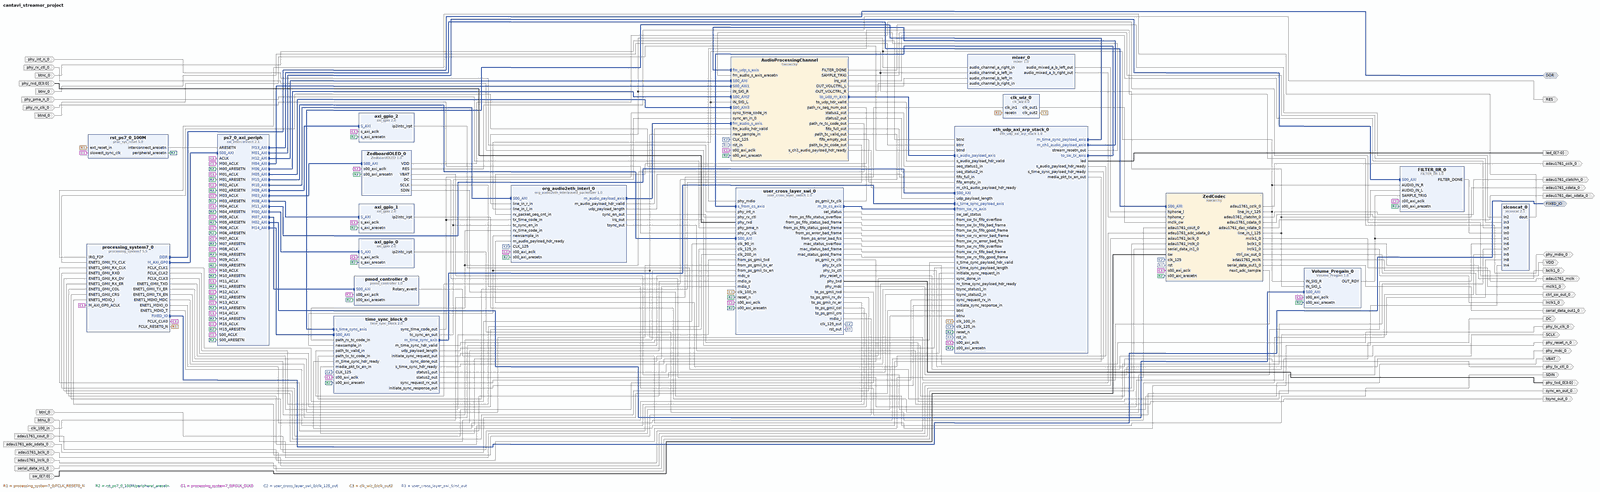
[diagram p0: block diagram of the top level, whole]
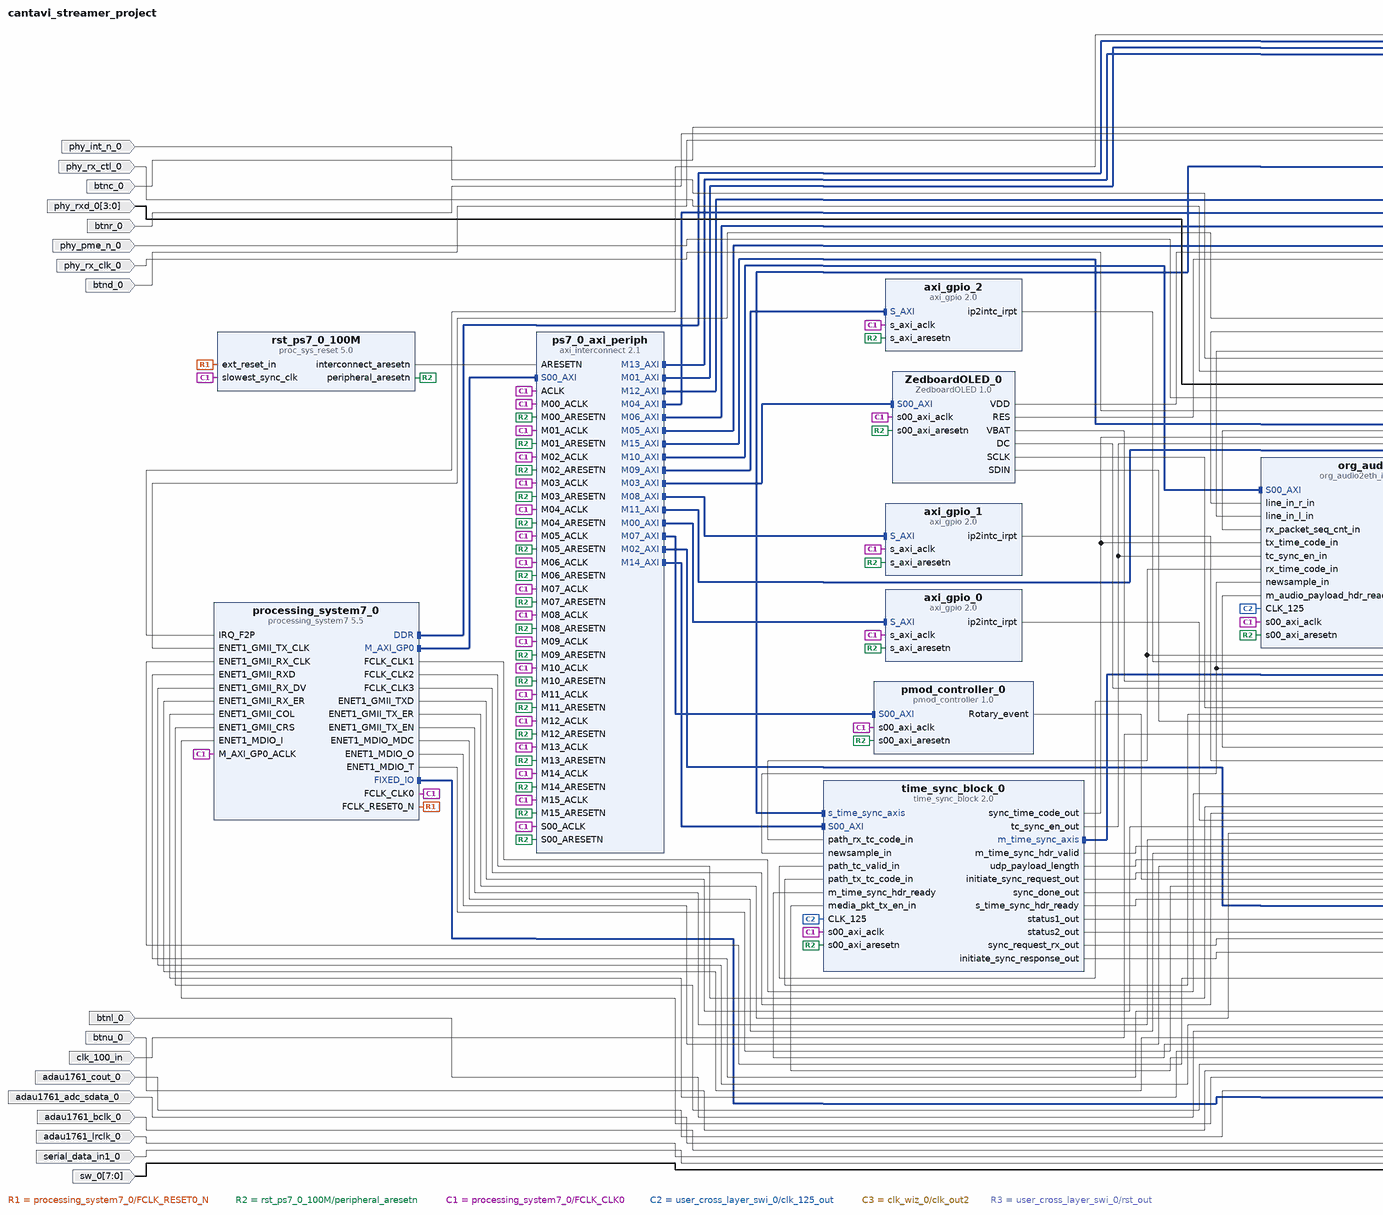
[diagram p1: block diagram of the top level, left part]
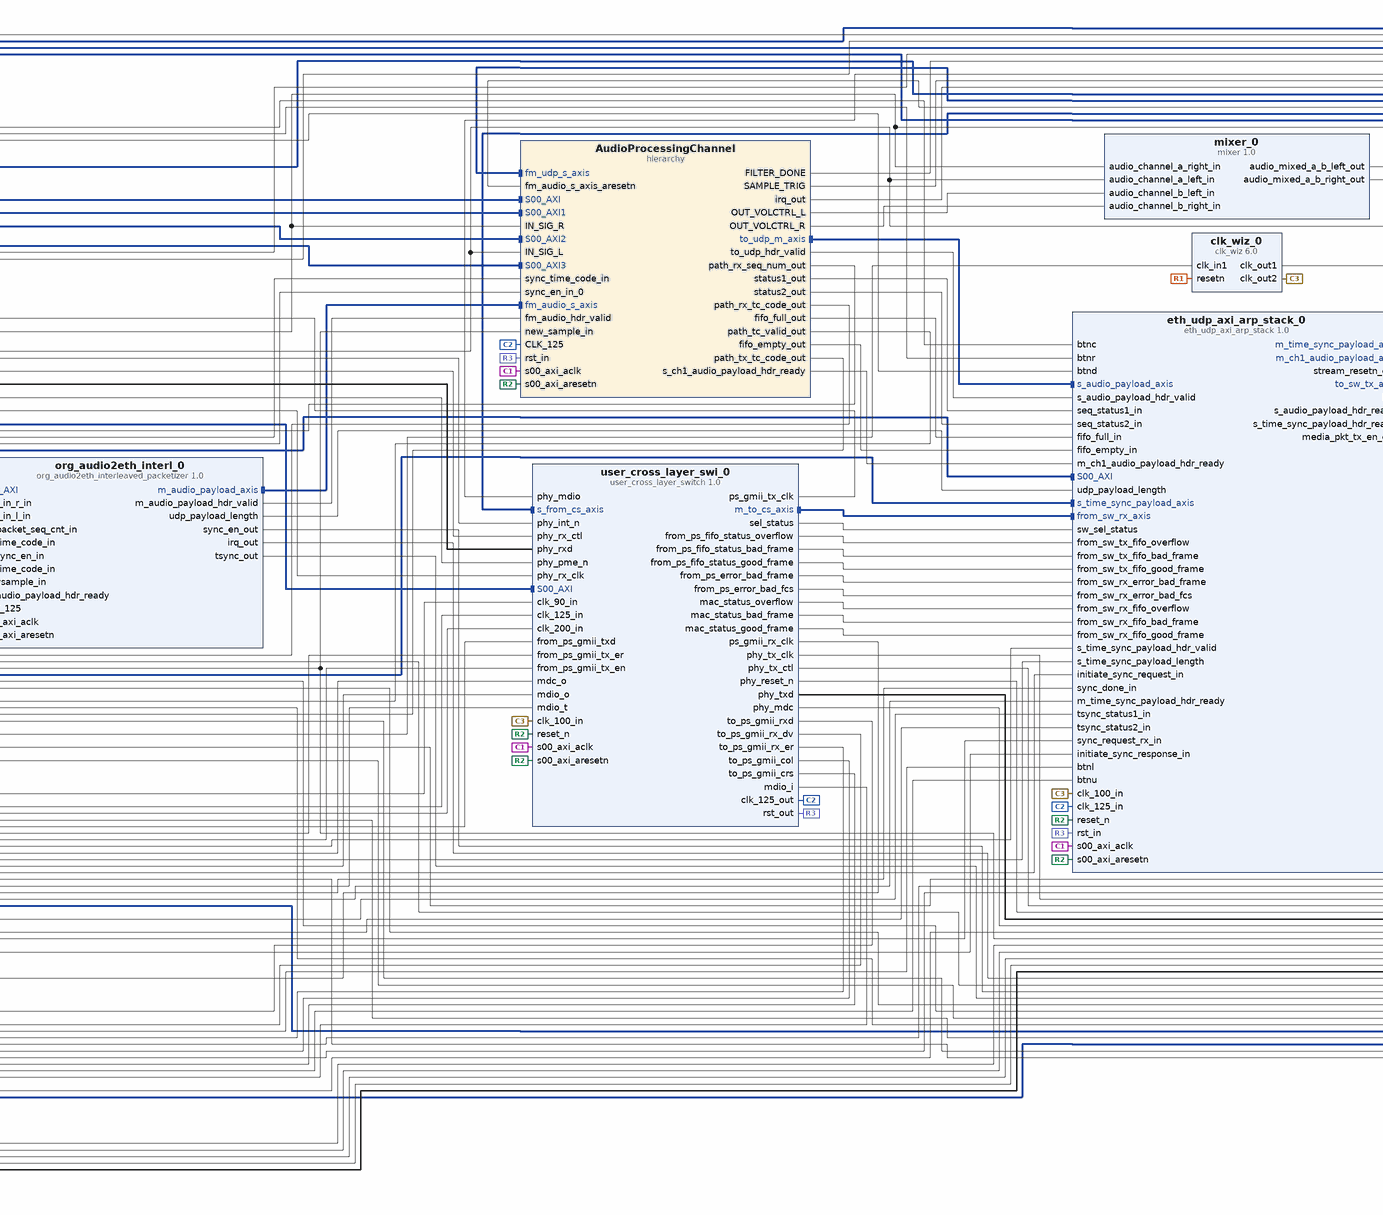
[diagram p2: block diagram of the top level, centre part]
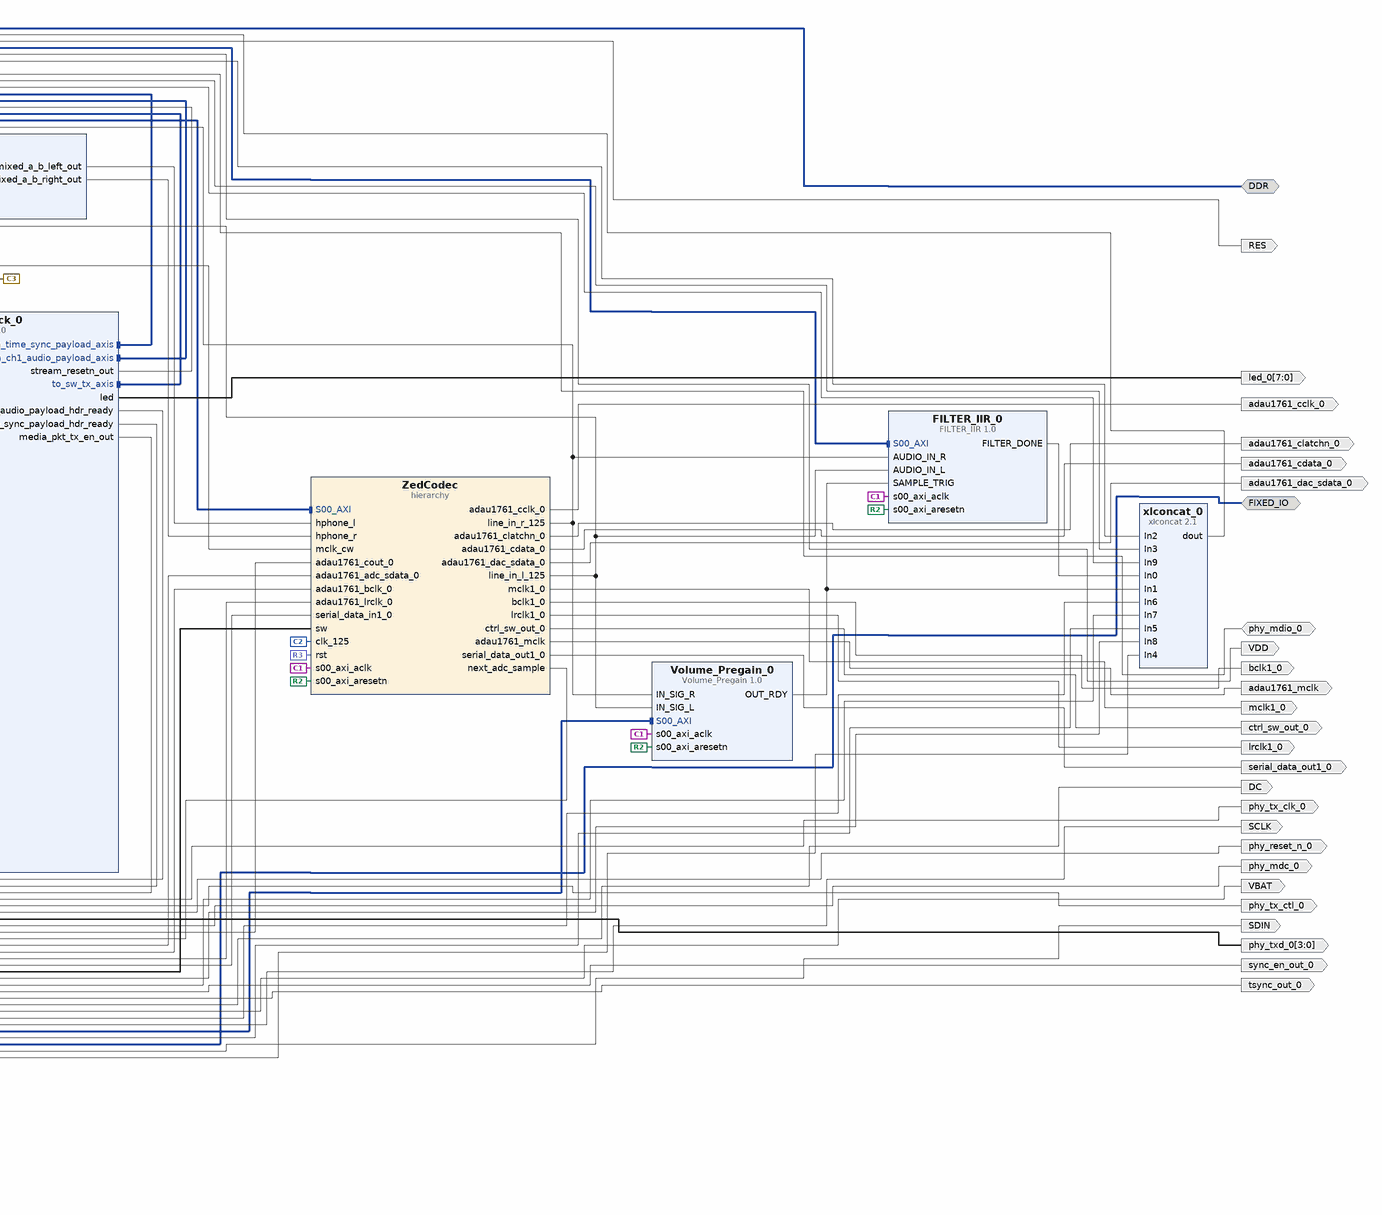
[diagram p3: block diagram of the top level, right part]
# Vivado block design cantavi_streamer_project, xc7z020clg484-1, Vivado 2018.3
create_bd_design cantavi_streamer_project

create_bd_intf_port -mode Master -vlnv xilinx.com:interface:ddrx_rtl:1.0 DDR
create_bd_intf_port -mode Master -vlnv xilinx.com:display_processing_system7:fixedio_rtl:1.0 FIXED_IO
create_bd_port -dir O VDD
create_bd_port -dir O RES
create_bd_port -dir O VBAT
create_bd_port -dir O DC
create_bd_port -dir O SCLK
create_bd_port -dir O SDIN
create_bd_port -dir O -from 3 -to 0 phy_txd_0
create_bd_port -dir O phy_tx_ctl_0
create_bd_port -dir O phy_reset_n_0
create_bd_port -dir I phy_int_n_0
create_bd_port -dir I phy_rx_ctl_0
create_bd_port -dir I -from 3 -to 0 phy_rxd_0
create_bd_port -dir I phy_pme_n_0
create_bd_port -dir O phy_tx_clk_0
create_bd_port -dir I -type clk phy_rx_clk_0
set_property -dict {CONFIG.FREQ_HZ 125000000} [get_bd_ports phy_rx_clk_0]
create_bd_port -dir O -from 7 -to 0 led_0
create_bd_port -dir I btnc_0
create_bd_port -dir I btnr_0
create_bd_port -dir I btnd_0
create_bd_port -dir I btnl_0
create_bd_port -dir I btnu_0
create_bd_port -dir I -type clk clk_100_in
set_property -dict {CONFIG.FREQ_HZ 100000000 CONFIG.PHASE 0.000} [get_bd_ports clk_100_in]
create_bd_port -dir O adau1761_cclk_0
create_bd_port -dir O adau1761_clatchn_0
create_bd_port -dir O adau1761_cdata_0
create_bd_port -dir I adau1761_cout_0
create_bd_port -dir O adau1761_dac_sdata_0
create_bd_port -dir I adau1761_adc_sdata_0
create_bd_port -dir I adau1761_bclk_0
create_bd_port -dir I adau1761_lrclk_0
create_bd_port -dir O -type clk adau1761_mclk
set_property -dict {CONFIG.FREQ_HZ 12288786} [get_bd_ports adau1761_mclk]
create_bd_port -dir O tsync_out_0
create_bd_port -dir O sync_en_out_0
create_bd_port -dir IO phy_mdio_0
create_bd_port -dir O phy_mdc_0
create_bd_port -dir I serial_data_in1_0
create_bd_port -dir O mclk1_0
create_bd_port -dir O bclk1_0
create_bd_port -dir O lrclk1_0
create_bd_port -dir O ctrl_sw_out_0
create_bd_port -dir O serial_data_out1_0
create_bd_port -dir I -from 7 -to 0 sw_0

create_bd_cell -type ip -vlnv xilinx.com:ip:xlconcat:2.1 xlconcat_0
set_property -dict {CONFIG.NUM_PORTS 10} [get_bd_cells xlconcat_0]
create_bd_cell -type ip -vlnv xilinx.com:ip:axi_gpio:2.0 axi_gpio_0
set_property -dict [list \
  CONFIG.C_INTERRUPT_PRESENT 1 \
  CONFIG.GPIO_BOARD_INTERFACE btns_5bits \
  CONFIG.USE_BOARD_FLOW true \
] [get_bd_cells axi_gpio_0]
create_bd_cell -type ip -vlnv xilinx.com:ip:axi_gpio:2.0 axi_gpio_1
set_property -dict [list \
  CONFIG.C_INTERRUPT_PRESENT 1 \
  CONFIG.GPIO_BOARD_INTERFACE sws_8bits \
  CONFIG.USE_BOARD_FLOW true \
] [get_bd_cells axi_gpio_1]
create_bd_cell -type ip -vlnv xilinx.com:ip:axi_gpio:2.0 axi_gpio_2
set_property -dict [list \
  CONFIG.C_INTERRUPT_PRESENT 1 \
  CONFIG.GPIO_BOARD_INTERFACE leds_8bits \
  CONFIG.USE_BOARD_FLOW true \
] [get_bd_cells axi_gpio_2]
create_bd_cell -type ip -vlnv xilinx.com:ip:processing_system7:5.5 processing_system7_0
set_property -dict [list \
  CONFIG.PCW_APU_PERIPHERAL_FREQMHZ 666.666667 \
  CONFIG.PCW_ENET0_ENET0_IO {MIO 16 .. 27} \
  CONFIG.PCW_ENET0_GRP_MDIO_ENABLE 1 \
  CONFIG.PCW_ENET0_GRP_MDIO_IO {MIO 52 .. 53} \
  CONFIG.PCW_ENET0_PERIPHERAL_ENABLE 1 \
  CONFIG.PCW_ENET0_RESET_ENABLE 0 \
  CONFIG.PCW_ENET1_ENET1_IO EMIO \
  CONFIG.PCW_ENET1_GRP_MDIO_ENABLE 1 \
  CONFIG.PCW_ENET1_GRP_MDIO_IO EMIO \
  CONFIG.PCW_ENET1_PERIPHERAL_ENABLE 1 \
  CONFIG.PCW_ENET_RESET_ENABLE 1 \
  CONFIG.PCW_ENET_RESET_SELECT {Share reset pin} \
  CONFIG.PCW_EN_CLK1_PORT 1 \
  CONFIG.PCW_EN_CLK2_PORT 1 \
  CONFIG.PCW_EN_CLK3_PORT 1 \
  CONFIG.PCW_FCLK_CLK1_BUF TRUE \
  CONFIG.PCW_FCLK_CLK2_BUF TRUE \
  CONFIG.PCW_FCLK_CLK3_BUF TRUE \
  CONFIG.PCW_FPGA0_PERIPHERAL_FREQMHZ 100.000000 \
  CONFIG.PCW_FPGA1_PERIPHERAL_FREQMHZ 90 \
  CONFIG.PCW_FPGA2_PERIPHERAL_FREQMHZ 125 \
  CONFIG.PCW_FPGA3_PERIPHERAL_FREQMHZ 200 \
  CONFIG.PCW_FPGA_FCLK1_ENABLE 1 \
  CONFIG.PCW_FPGA_FCLK2_ENABLE 1 \
  CONFIG.PCW_FPGA_FCLK3_ENABLE 1 \
  CONFIG.PCW_GPIO_MIO_GPIO_ENABLE 1 \
  CONFIG.PCW_GPIO_MIO_GPIO_IO MIO \
  CONFIG.PCW_I2C_RESET_ENABLE 1 \
  CONFIG.PCW_IRQ_F2P_INTR 1 \
  CONFIG.PCW_PERIPHERAL_BOARD_PRESET part0 \
  CONFIG.PCW_PRESET_BANK1_VOLTAGE {LVCMOS 1.8V} \
  CONFIG.PCW_QSPI_GRP_SINGLE_SS_ENABLE 1 \
  CONFIG.PCW_QSPI_GRP_SINGLE_SS_IO {MIO 1 .. 6} \
  CONFIG.PCW_QSPI_PERIPHERAL_ENABLE 1 \
  CONFIG.PCW_QSPI_QSPI_IO {MIO 1 .. 6} \
  CONFIG.PCW_SD0_GRP_CD_ENABLE 1 \
  CONFIG.PCW_SD0_GRP_CD_IO {MIO 47} \
  CONFIG.PCW_SD0_GRP_WP_ENABLE 1 \
  CONFIG.PCW_SD0_GRP_WP_IO {MIO 46} \
  CONFIG.PCW_SD0_PERIPHERAL_ENABLE 1 \
  CONFIG.PCW_SD0_SD0_IO {MIO 40 .. 45} \
  CONFIG.PCW_SDIO_PERIPHERAL_FREQMHZ 50 \
  CONFIG.PCW_SINGLE_QSPI_DATA_MODE x4 \
  CONFIG.PCW_TTC0_PERIPHERAL_ENABLE 1 \
  CONFIG.PCW_TTC0_TTC0_IO EMIO \
  CONFIG.PCW_UART1_PERIPHERAL_ENABLE 1 \
  CONFIG.PCW_UART1_UART1_IO {MIO 48 .. 49} \
  CONFIG.PCW_UART_PERIPHERAL_FREQMHZ 50 \
  CONFIG.PCW_UIPARAM_DDR_FREQ_MHZ 533.333313 \
  CONFIG.PCW_UIPARAM_DDR_PARTNO {MT41J128M16 HA-15E} \
  CONFIG.PCW_UIPARAM_GENERATE_SUMMARY NONE \
  CONFIG.PCW_USB0_PERIPHERAL_ENABLE 0 \
  CONFIG.PCW_USB_RESET_ENABLE 1 \
  CONFIG.PCW_USE_FABRIC_INTERRUPT 1 \
  CONFIG.preset ZedBoard \
] [get_bd_cells processing_system7_0]
# 509 more settings of processing_system7_0 are not shown: defaults, MIO pin electricals, DDR timing, and values the tool derives
create_bd_cell -type ip -vlnv xilinx.com:ip:axi_interconnect:2.1 ps7_0_axi_periph
set_property -dict {CONFIG.NUM_MI 16} [get_bd_cells ps7_0_axi_periph]
create_bd_cell -type ip -vlnv xilinx.com:ip:proc_sys_reset:5.0 rst_ps7_0_100M
create_bd_cell -type hier ZedCodec
create_bd_cell -type ip -vlnv xilinx.com:ip:clk_wiz:6.0 clk_wiz_0
set_property -dict [list \
  CONFIG.CLKOUT1_JITTER 201.426 \
  CONFIG.CLKOUT1_PHASE_ERROR 98.575 \
  CONFIG.CLKOUT1_REQUESTED_OUT_FREQ 12.288 \
  CONFIG.CLKOUT2_JITTER 130.958 \
  CONFIG.CLKOUT2_PHASE_ERROR 98.575 \
  CONFIG.CLKOUT2_USED true \
  CONFIG.ENABLE_CLOCK_MONITOR false \
  CONFIG.MMCM_CLKFBOUT_MULT_F 10.000 \
  CONFIG.MMCM_CLKOUT0_DIVIDE_F 81.375 \
  CONFIG.MMCM_CLKOUT1_DIVIDE 10 \
  CONFIG.MMCM_DIVCLK_DIVIDE 1 \
  CONFIG.NUM_OUT_CLKS 2 \
  CONFIG.PRIMITIVE MMCM \
  CONFIG.RESET_PORT resetn \
  CONFIG.RESET_TYPE ACTIVE_LOW \
] [get_bd_cells clk_wiz_0]
create_bd_cell -type hier AudioProcessingChannel
create_bd_cell -type ip -vlnv user.org:user:mixer:1.0 mixer_0
create_bd_cell -type ip -vlnv tsotnep:userLibrary:FILTER_IIR:1.0 FILTER_IIR_0
create_bd_cell -type ip -vlnv ttu.ee:user:pmod_controller:1.0 pmod_controller_0
create_bd_cell -type ip -vlnv tamu.edu:user:ZedboardOLED:1.0 ZedboardOLED_0
create_bd_cell -type ip -vlnv user.org:user:user_cross_layer_switch:1.0 user_cross_layer_swi_0
set_property -dict [list \
  CONFIG.FROM_CS_FIFO_ADDR_WIDTH 9 \
  CONFIG.RX_FIFO_ADDR_WIDTH 12 \
  CONFIG.RX_HDR_FIFO_DEPTH 64 \
  CONFIG.TX_FIFO_ADDR_WIDTH 12 \
] [get_bd_cells user_cross_layer_swi_0]
create_bd_cell -type ip -vlnv user.org:user:org_audio2eth_interleaved_packetizer:1.0 org_audio2eth_interl_0
set_property -dict {CONFIG.PACKET_LEN_WIDTH 16} [get_bd_cells org_audio2eth_interl_0]
create_bd_cell -type ip -vlnv me:user:time_sync_block:2.0 time_sync_block_0
create_bd_cell -type ip -vlnv user.org:user:eth_udp_axi_arp_stack:1.0 eth_udp_axi_arp_stack_0
create_bd_cell -type ip -vlnv tsotnep:userLibrary:Volume_Pregain:1.0 Volume_Pregain_0

# ---- hierarchy /ZedCodec ----
current_bd_instance /ZedCodec
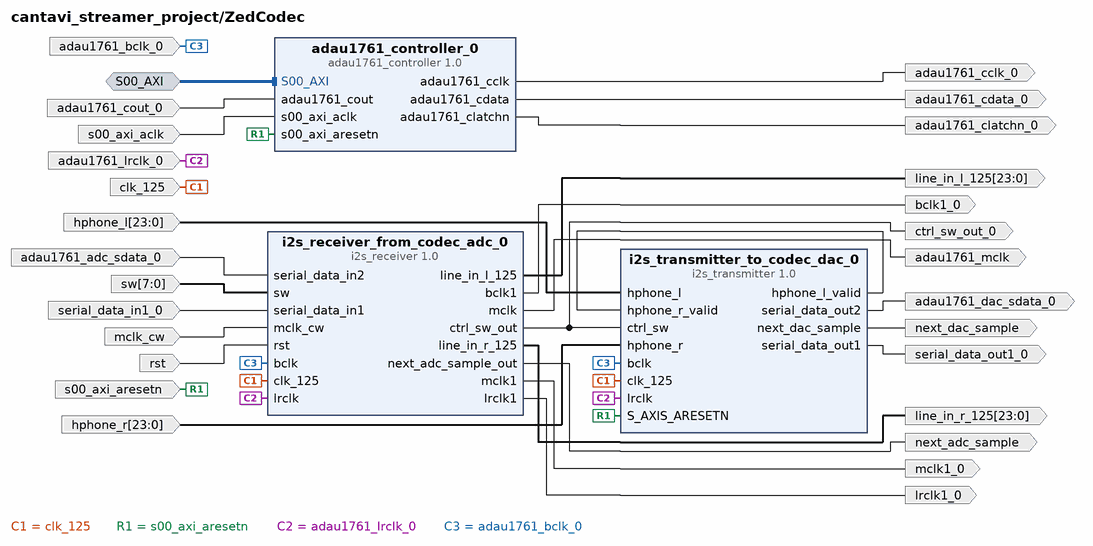
[diagram p4: block diagram inside /ZedCodec]
create_bd_intf_pin -mode Slave -vlnv xilinx.com:interface:aximm_rtl:1.0 S00_AXI
create_bd_pin -dir O adau1761_cclk_0
create_bd_pin -dir O adau1761_clatchn_0
create_bd_pin -dir O adau1761_cdata_0
create_bd_pin -dir I adau1761_cout_0
create_bd_pin -dir I adau1761_bclk_0
create_bd_pin -dir I adau1761_lrclk_0
create_bd_pin -dir I adau1761_adc_sdata_0
create_bd_pin -dir O adau1761_dac_sdata_0
create_bd_pin -dir I -from 23 -to 0 hphone_l
create_bd_pin -dir I -from 23 -to 0 hphone_r
create_bd_pin -dir I clk_125
create_bd_pin -dir O next_dac_sample
create_bd_pin -dir O next_adc_sample
create_bd_pin -dir O -from 23 -to 0 line_in_l_125
create_bd_pin -dir O -from 23 -to 0 line_in_r_125
create_bd_pin -dir I -type rst s00_axi_aresetn
create_bd_pin -dir I -type clk s00_axi_aclk
create_bd_pin -dir I -from 7 -to 0 sw
create_bd_pin -dir I serial_data_in1_0
create_bd_pin -dir O mclk1_0
create_bd_pin -dir O bclk1_0
create_bd_pin -dir O lrclk1_0
create_bd_pin -dir O ctrl_sw_out_0
create_bd_pin -dir O adau1761_mclk
create_bd_pin -dir I mclk_cw
create_bd_pin -dir O serial_data_out1_0
create_bd_pin -dir I -type rst rst

create_bd_cell -type ip -vlnv user.org:user:adau1761_controller:1.0 adau1761_controller_0
create_bd_cell -type ip -vlnv user.org:user:i2s_transmitter:1.0 i2s_transmitter_to_codec_dac_0
create_bd_cell -type ip -vlnv user.org:user:i2s_receiver:1.0 i2s_receiver_from_codec_adc_0

# ---- hierarchy /AudioProcessingChannel ----
current_bd_instance /AudioProcessingChannel
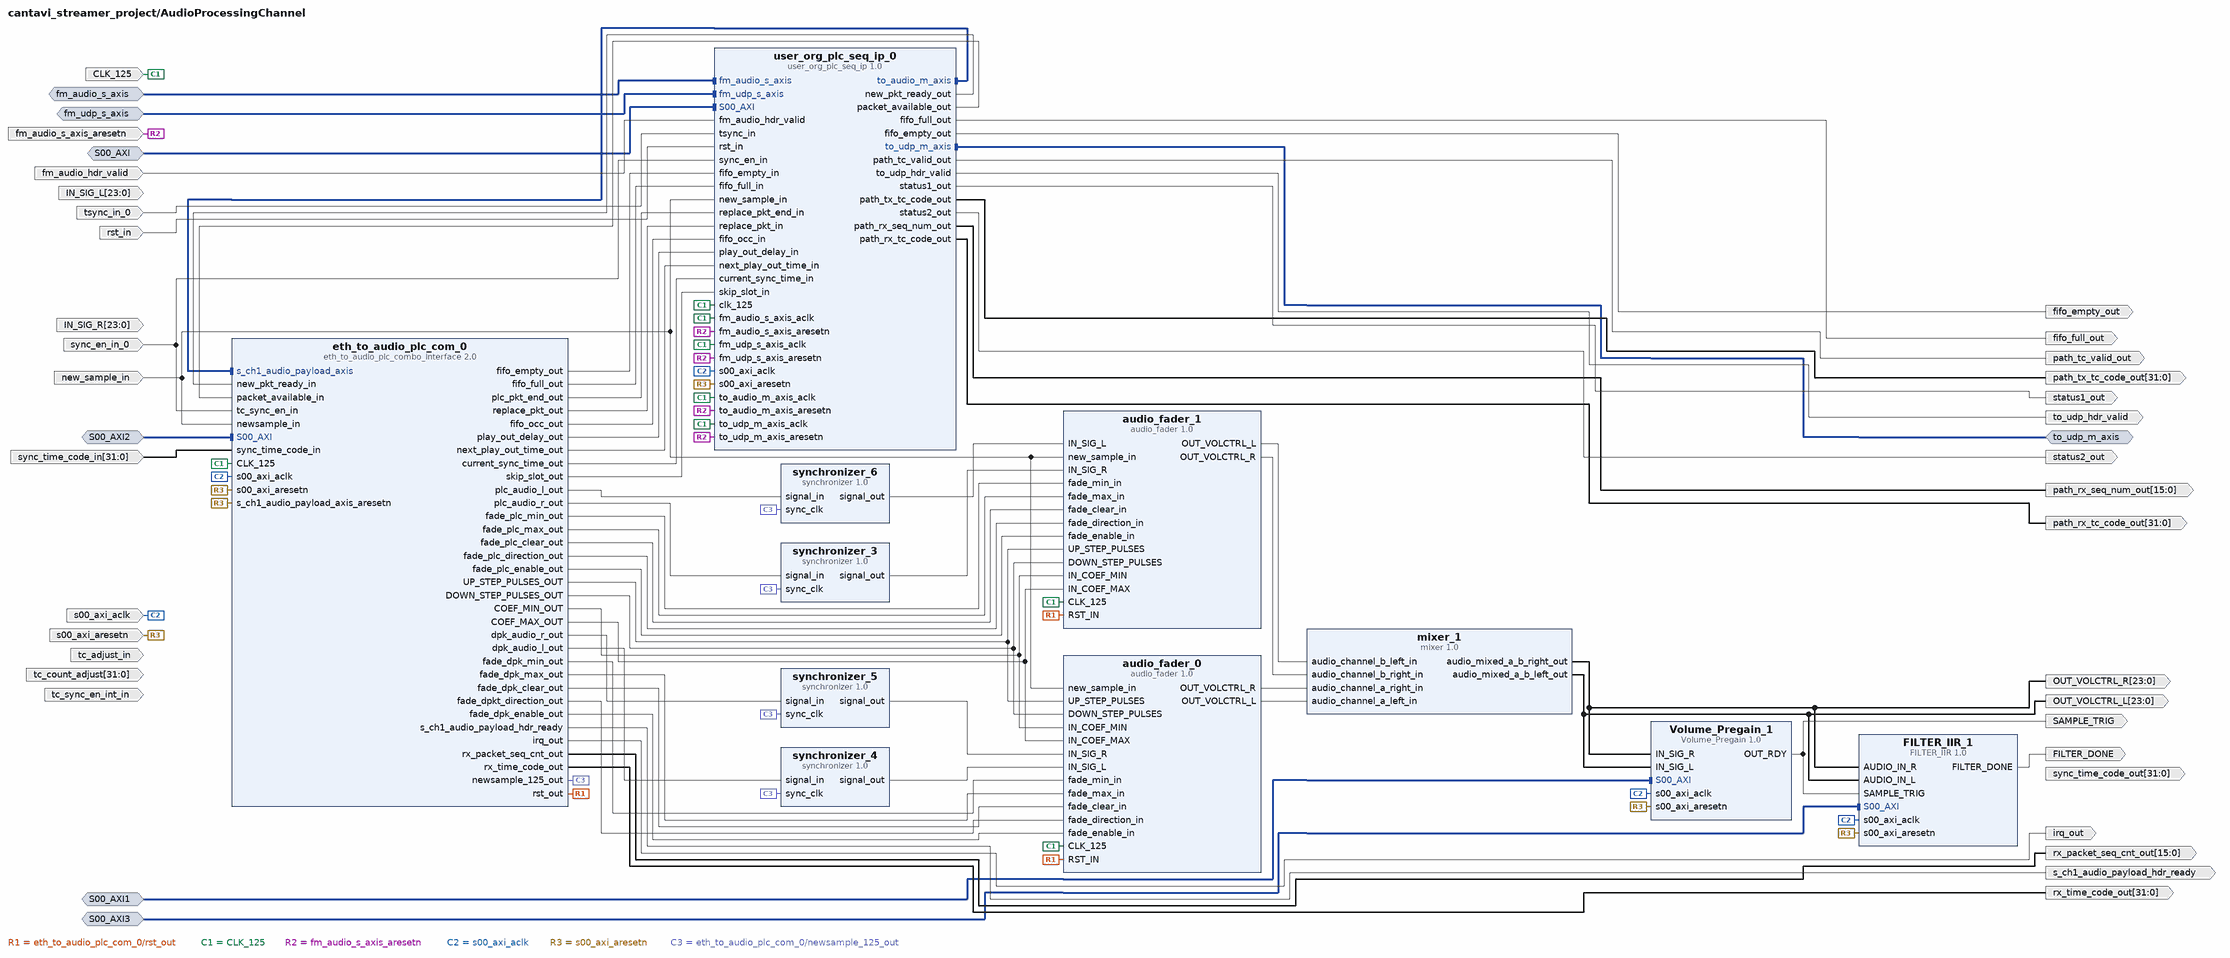
[diagram p5: block diagram inside /AudioProcessingChannel]
create_bd_intf_pin -mode Slave -vlnv xilinx.com:interface:aximm_rtl:1.0 S00_AXI
create_bd_intf_pin -mode Slave -vlnv xilinx.com:interface:axis_rtl:1.0 fm_audio_s_axis
create_bd_intf_pin -mode Slave -vlnv xilinx.com:interface:axis_rtl:1.0 fm_udp_s_axis
create_bd_intf_pin -mode Master -vlnv xilinx.com:interface:axis_rtl:1.0 to_udp_m_axis
create_bd_intf_pin -mode Slave -vlnv xilinx.com:interface:aximm_rtl:1.0 S00_AXI1
create_bd_intf_pin -mode Slave -vlnv xilinx.com:interface:aximm_rtl:1.0 S00_AXI3
create_bd_intf_pin -mode Slave -vlnv xilinx.com:interface:aximm_rtl:1.0 S00_AXI2
create_bd_pin -dir I -type clk CLK_125
create_bd_pin -dir I new_sample_in
create_bd_pin -dir I -type rst fm_audio_s_axis_aresetn
create_bd_pin -dir I fm_audio_hdr_valid
create_bd_pin -dir O to_udp_hdr_valid
create_bd_pin -dir O fifo_full_out
create_bd_pin -dir O fifo_empty_out
create_bd_pin -dir O status1_out
create_bd_pin -dir O status2_out
create_bd_pin -dir I tsync_in_0
create_bd_pin -dir I sync_en_in_0
create_bd_pin -dir I -type clk s00_axi_aclk
create_bd_pin -dir I -type rst s00_axi_aresetn
create_bd_pin -dir O -from 23 -to 0 OUT_VOLCTRL_L
create_bd_pin -dir O -from 23 -to 0 OUT_VOLCTRL_R
create_bd_pin -dir O SAMPLE_TRIG
create_bd_pin -dir I tc_adjust_in
create_bd_pin -dir I -from 31 -to 0 tc_count_adjust
create_bd_pin -dir I tc_sync_en_int_in
create_bd_pin -dir O -from 31 -to 0 sync_time_code_out
create_bd_pin -dir O FILTER_DONE
create_bd_pin -dir I rst_in
create_bd_pin -dir O path_tc_valid_out
create_bd_pin -dir O -from 31 -to 0 path_tx_tc_code_out
create_bd_pin -dir O -from 31 -to 0 path_rx_tc_code_out
create_bd_pin -dir O -from 15 -to 0 path_rx_seq_num_out
create_bd_pin -dir I -from 23 -to 0 IN_SIG_L
create_bd_pin -dir I -from 23 -to 0 IN_SIG_R
create_bd_pin -dir O s_ch1_audio_payload_hdr_ready
create_bd_pin -dir O irq_out
create_bd_pin -dir O -from 15 -to 0 rx_packet_seq_cnt_out
create_bd_pin -dir O -from 31 -to 0 rx_time_code_out
create_bd_pin -dir I -from 31 -to 0 sync_time_code_in

create_bd_cell -type ip -vlnv user.org:user:mixer:1.0 mixer_1
create_bd_cell -type ip -vlnv tsotnep:userLibrary:FILTER_IIR:1.0 FILTER_IIR_1
create_bd_cell -type ip -vlnv user.org:user:synchronizer:1.0 synchronizer_3
create_bd_cell -type ip -vlnv user.org:user:synchronizer:1.0 synchronizer_4
create_bd_cell -type ip -vlnv user.org:user:synchronizer:1.0 synchronizer_5
create_bd_cell -type ip -vlnv user.org:user:synchronizer:1.0 synchronizer_6
create_bd_cell -type ip -vlnv user.org:user:audio_fader:1.0 audio_fader_0
create_bd_cell -type ip -vlnv user.org:user:audio_fader:1.0 audio_fader_1
create_bd_cell -type ip -vlnv user.org:user:user_org_plc_seq_ip:1.0 user_org_plc_seq_ip_0
set_property -dict [list \
  CONFIG.CORE_VERSION 22 \
  CONFIG.FIFO_ADDR_WIDTH 10 \
  CONFIG.SEQ_BANK_FIFO_ADDR_WIDTH 9 \
  CONFIG.S_COUNT 64 \
] [get_bd_cells user_org_plc_seq_ip_0]
create_bd_cell -type ip -vlnv me:user:eth_to_audio_plc_combo_interface:2.0 eth_to_audio_plc_com_0
set_property -dict [list \
  CONFIG.CIC_SIG_OUT_WIDTH 28 \
  CONFIG.COMP_SIG_OUT_WIDTH 28 \
  CONFIG.ENTRY_FADE_LENGTH 96 \
  CONFIG.EXIT_FADE_LENGTH 96 \
  CONFIG.FIFO_ADDR_WIDTH 8 \
  CONFIG.LIFO_ADDR_WIDTH 13 \
  CONFIG.REL_PIPE_LENGTH 12 \
  CONFIG.S_COUNT 32 \
] [get_bd_cells eth_to_audio_plc_com_0]
create_bd_cell -type ip -vlnv tsotnep:userLibrary:Volume_Pregain:1.0 Volume_Pregain_1

# ---- connections ----

current_bd_instance /ZedCodec
connect_bd_intf_net [get_bd_intf_pins S00_AXI] [get_bd_intf_pins adau1761_controller_0/S00_AXI]
connect_bd_net [get_bd_pins adau1761_controller_0/adau1761_cclk] [get_bd_pins adau1761_cclk_0]
connect_bd_net [get_bd_pins adau1761_controller_0/adau1761_clatchn] [get_bd_pins adau1761_clatchn_0]
connect_bd_net [get_bd_pins adau1761_controller_0/adau1761_cdata] [get_bd_pins adau1761_cdata_0]
connect_bd_net -net adau1761_cout_0_1 [get_bd_pins adau1761_cout_0] [get_bd_pins adau1761_controller_0/adau1761_cout]
connect_bd_net [get_bd_pins adau1761_adc_sdata_0] [get_bd_pins i2s_receiver_from_codec_adc_0/serial_data_in2]
connect_bd_net -net i2s_transmitter_0_sd [get_bd_pins i2s_transmitter_to_codec_dac_0/serial_data_out2] [get_bd_pins adau1761_dac_sdata_0]
connect_bd_net [get_bd_pins hphone_l] [get_bd_pins i2s_transmitter_to_codec_dac_0/hphone_l]
connect_bd_net [get_bd_pins hphone_r] [get_bd_pins i2s_transmitter_to_codec_dac_0/hphone_r]
connect_bd_net -net clk_125_1 [get_bd_pins clk_125] \
  [get_bd_pins i2s_transmitter_to_codec_dac_0/clk_125] [get_bd_pins i2s_receiver_from_codec_adc_0/clk_125]
connect_bd_net [get_bd_pins i2s_transmitter_to_codec_dac_0/next_dac_sample] [get_bd_pins next_dac_sample]
connect_bd_net -net i2s_receiver_from_codec_adc_0_next_adc_sample [get_bd_pins i2s_receiver_from_codec_adc_0/next_adc_sample_out] \
  [get_bd_pins next_adc_sample]
connect_bd_net [get_bd_pins i2s_receiver_from_codec_adc_0/line_in_l_125] [get_bd_pins line_in_l_125]
connect_bd_net [get_bd_pins i2s_receiver_from_codec_adc_0/line_in_r_125] [get_bd_pins line_in_r_125]
connect_bd_net [get_bd_pins s00_axi_aresetn] \
  [get_bd_pins adau1761_controller_0/s00_axi_aresetn] [get_bd_pins i2s_transmitter_to_codec_dac_0/S_AXIS_ARESETN]
connect_bd_net [get_bd_pins s00_axi_aclk] [get_bd_pins adau1761_controller_0/s00_axi_aclk]
connect_bd_net [get_bd_pins i2s_transmitter_to_codec_dac_0/hphone_l_valid] [get_bd_pins i2s_transmitter_to_codec_dac_0/hphone_r_valid]
connect_bd_net [get_bd_pins adau1761_lrclk_0] [get_bd_pins i2s_transmitter_to_codec_dac_0/lrclk] [get_bd_pins i2s_receiver_from_codec_adc_0/lrclk]
connect_bd_net [get_bd_pins adau1761_bclk_0] [get_bd_pins i2s_transmitter_to_codec_dac_0/bclk] [get_bd_pins i2s_receiver_from_codec_adc_0/bclk]
connect_bd_net [get_bd_pins sw] [get_bd_pins i2s_receiver_from_codec_adc_0/sw]
connect_bd_net -net serial_data_in1_0_1 [get_bd_pins serial_data_in1_0] [get_bd_pins i2s_receiver_from_codec_adc_0/serial_data_in1]
connect_bd_net [get_bd_pins i2s_receiver_from_codec_adc_0/mclk1] [get_bd_pins mclk1_0]
connect_bd_net [get_bd_pins i2s_receiver_from_codec_adc_0/bclk1] [get_bd_pins bclk1_0]
connect_bd_net [get_bd_pins i2s_receiver_from_codec_adc_0/lrclk1] [get_bd_pins lrclk1_0]
connect_bd_net [get_bd_pins i2s_receiver_from_codec_adc_0/ctrl_sw_out] \
  [get_bd_pins ctrl_sw_out_0] [get_bd_pins i2s_transmitter_to_codec_dac_0/ctrl_sw]
connect_bd_net [get_bd_pins i2s_receiver_from_codec_adc_0/mclk] [get_bd_pins adau1761_mclk]
connect_bd_net [get_bd_pins mclk_cw] [get_bd_pins i2s_receiver_from_codec_adc_0/mclk_cw]
connect_bd_net [get_bd_pins i2s_transmitter_to_codec_dac_0/serial_data_out1] [get_bd_pins serial_data_out1_0]
connect_bd_net [get_bd_pins rst] [get_bd_pins i2s_receiver_from_codec_adc_0/rst]

current_bd_instance /AudioProcessingChannel
connect_bd_intf_net [get_bd_intf_pins S00_AXI1] [get_bd_intf_pins Volume_Pregain_1/S00_AXI]
connect_bd_intf_net [get_bd_intf_pins to_udp_m_axis] [get_bd_intf_pins user_org_plc_seq_ip_0/to_udp_m_axis]
connect_bd_intf_net [get_bd_intf_pins fm_audio_s_axis] [get_bd_intf_pins user_org_plc_seq_ip_0/fm_audio_s_axis]
connect_bd_intf_net [get_bd_intf_pins S00_AXI3] [get_bd_intf_pins FILTER_IIR_1/S00_AXI]
connect_bd_intf_net -intf_net full_udp_stack_ip_0_m_ch1_audio_payload_axis [get_bd_intf_pins fm_udp_s_axis] [get_bd_intf_pins user_org_plc_seq_ip_0/fm_udp_s_axis]
connect_bd_intf_net [get_bd_intf_pins S00_AXI2] [get_bd_intf_pins eth_to_audio_plc_com_0/S00_AXI]
connect_bd_intf_net [get_bd_intf_pins S00_AXI] [get_bd_intf_pins user_org_plc_seq_ip_0/S00_AXI]
connect_bd_intf_net [get_bd_intf_pins user_org_plc_seq_ip_0/to_audio_m_axis] [get_bd_intf_pins eth_to_audio_plc_com_0/s_ch1_audio_payload_axis]
connect_bd_net [get_bd_pins mixer_1/audio_mixed_a_b_right_out] \
  [get_bd_pins FILTER_IIR_1/AUDIO_IN_R] [get_bd_pins OUT_VOLCTRL_R] [get_bd_pins Volume_Pregain_1/IN_SIG_R]
connect_bd_net [get_bd_pins eth_to_audio_plc_com_0/UP_STEP_PULSES_OUT] \
  [get_bd_pins audio_fader_0/UP_STEP_PULSES] [get_bd_pins audio_fader_1/UP_STEP_PULSES]
connect_bd_net [get_bd_pins eth_to_audio_plc_com_0/DOWN_STEP_PULSES_OUT] \
  [get_bd_pins audio_fader_0/DOWN_STEP_PULSES] [get_bd_pins audio_fader_1/DOWN_STEP_PULSES]
connect_bd_net [get_bd_pins eth_to_audio_plc_com_0/COEF_MIN_OUT] [get_bd_pins audio_fader_0/IN_COEF_MIN] [get_bd_pins audio_fader_1/IN_COEF_MIN]
connect_bd_net [get_bd_pins eth_to_audio_plc_com_0/COEF_MAX_OUT] [get_bd_pins audio_fader_0/IN_COEF_MAX] [get_bd_pins audio_fader_1/IN_COEF_MAX]
connect_bd_net [get_bd_pins eth_to_audio_plc_com_0/rst_out] [get_bd_pins audio_fader_0/RST_IN] [get_bd_pins audio_fader_1/RST_IN]
connect_bd_net [get_bd_pins eth_to_audio_plc_com_0/plc_audio_l_out] [get_bd_pins synchronizer_6/signal_in]
connect_bd_net [get_bd_pins eth_to_audio_plc_com_0/plc_audio_r_out] [get_bd_pins synchronizer_3/signal_in]
connect_bd_net -net clk_wiz_0_clk_125_out1 [get_bd_pins CLK_125] \
  [get_bd_pins audio_fader_0/CLK_125] [get_bd_pins audio_fader_1/CLK_125] [get_bd_pins user_org_plc_seq_ip_0/clk_125] \
  [get_bd_pins user_org_plc_seq_ip_0/fm_udp_s_axis_aclk] [get_bd_pins user_org_plc_seq_ip_0/fm_audio_s_axis_aclk] \
  [get_bd_pins user_org_plc_seq_ip_0/to_udp_m_axis_aclk] [get_bd_pins user_org_plc_seq_ip_0/to_audio_m_axis_aclk] \
  [get_bd_pins eth_to_audio_plc_com_0/CLK_125]
connect_bd_net -net ZedCodec_next_adc_sample [get_bd_pins new_sample_in] \
  [get_bd_pins audio_fader_0/new_sample_in] [get_bd_pins audio_fader_1/new_sample_in] \
  [get_bd_pins user_org_plc_seq_ip_0/new_sample_in] [get_bd_pins eth_to_audio_plc_com_0/newsample_in]
connect_bd_net [get_bd_pins fm_audio_s_axis_aresetn] \
  [get_bd_pins user_org_plc_seq_ip_0/fm_udp_s_axis_aresetn] [get_bd_pins user_org_plc_seq_ip_0/fm_audio_s_axis_aresetn] \
  [get_bd_pins user_org_plc_seq_ip_0/to_udp_m_axis_aresetn] [get_bd_pins user_org_plc_seq_ip_0/to_audio_m_axis_aresetn]
connect_bd_net -net audio_to_eth_interfa_0_m_audio_payload_hdr_valid [get_bd_pins fm_audio_hdr_valid] \
  [get_bd_pins user_org_plc_seq_ip_0/fm_audio_hdr_valid]
connect_bd_net [get_bd_pins user_org_plc_seq_ip_0/to_udp_hdr_valid] [get_bd_pins to_udp_hdr_valid]
connect_bd_net [get_bd_pins user_org_plc_seq_ip_0/fifo_full_out] [get_bd_pins fifo_full_out]
connect_bd_net [get_bd_pins user_org_plc_seq_ip_0/fifo_empty_out] [get_bd_pins fifo_empty_out]
connect_bd_net [get_bd_pins user_org_plc_seq_ip_0/status1_out] [get_bd_pins status1_out]
connect_bd_net [get_bd_pins user_org_plc_seq_ip_0/status2_out] [get_bd_pins status2_out]
connect_bd_net -net tsync_in_0_1 [get_bd_pins tsync_in_0] [get_bd_pins user_org_plc_seq_ip_0/tsync_in]
connect_bd_net -net sync_en_in_0_1 [get_bd_pins sync_en_in_0] \
  [get_bd_pins user_org_plc_seq_ip_0/sync_en_in] [get_bd_pins eth_to_audio_plc_com_0/tc_sync_en_in]
connect_bd_net -net clk_wiz_0_clk_100_out [get_bd_pins s00_axi_aclk] \
  [get_bd_pins FILTER_IIR_1/s00_axi_aclk] [get_bd_pins user_org_plc_seq_ip_0/s00_axi_aclk] \
  [get_bd_pins eth_to_audio_plc_com_0/s00_axi_aclk] [get_bd_pins Volume_Pregain_1/s00_axi_aclk]
connect_bd_net -net rst_ps7_0_100M_peripheral_aresetn [get_bd_pins s00_axi_aresetn] \
  [get_bd_pins FILTER_IIR_1/s00_axi_aresetn] [get_bd_pins user_org_plc_seq_ip_0/s00_axi_aresetn] \
  [get_bd_pins eth_to_audio_plc_com_0/s_ch1_audio_payload_axis_aresetn] [get_bd_pins eth_to_audio_plc_com_0/s00_axi_aresetn] \
  [get_bd_pins Volume_Pregain_1/s00_axi_aresetn]
connect_bd_net [get_bd_pins Volume_Pregain_1/OUT_RDY] [get_bd_pins SAMPLE_TRIG] [get_bd_pins FILTER_IIR_1/SAMPLE_TRIG]
# net time_sync_0_tc_adjust_out has one end: tc_adjust_in
# net time_sync_0_tc_count_adjusted_out has one end: tc_count_adjust
# net time_sync_0_tc_start has one end: tc_sync_en_int_in
# net eth_to_audio_plc_com_0_sync_time_code_out has one end: sync_time_code_out
connect_bd_net [get_bd_pins FILTER_IIR_1/FILTER_DONE] [get_bd_pins FILTER_DONE]
connect_bd_net [get_bd_pins rst_in] [get_bd_pins user_org_plc_seq_ip_0/rst_in]
connect_bd_net [get_bd_pins user_org_plc_seq_ip_0/path_tc_valid_out] [get_bd_pins path_tc_valid_out]
connect_bd_net [get_bd_pins user_org_plc_seq_ip_0/path_tx_tc_code_out] [get_bd_pins path_tx_tc_code_out]
connect_bd_net [get_bd_pins user_org_plc_seq_ip_0/path_rx_tc_code_out] [get_bd_pins path_rx_tc_code_out]
connect_bd_net [get_bd_pins user_org_plc_seq_ip_0/path_rx_seq_num_out] [get_bd_pins path_rx_seq_num_out]
connect_bd_net [get_bd_pins audio_fader_1/OUT_VOLCTRL_L] [get_bd_pins mixer_1/audio_channel_b_left_in]
connect_bd_net [get_bd_pins audio_fader_1/OUT_VOLCTRL_R] [get_bd_pins mixer_1/audio_channel_b_right_in]
connect_bd_net [get_bd_pins audio_fader_0/OUT_VOLCTRL_R] [get_bd_pins mixer_1/audio_channel_a_right_in]
connect_bd_net [get_bd_pins audio_fader_0/OUT_VOLCTRL_L] [get_bd_pins mixer_1/audio_channel_a_left_in]
connect_bd_net [get_bd_pins eth_to_audio_plc_com_0/s_ch1_audio_payload_hdr_ready] [get_bd_pins s_ch1_audio_payload_hdr_ready]
connect_bd_net [get_bd_pins eth_to_audio_plc_com_0/fade_plc_min_out] [get_bd_pins audio_fader_1/fade_min_in]
connect_bd_net [get_bd_pins eth_to_audio_plc_com_0/fade_plc_max_out] [get_bd_pins audio_fader_1/fade_max_in]
connect_bd_net [get_bd_pins eth_to_audio_plc_com_0/fade_dpk_min_out] [get_bd_pins audio_fader_0/fade_min_in]
connect_bd_net [get_bd_pins eth_to_audio_plc_com_0/fade_dpk_max_out] [get_bd_pins audio_fader_0/fade_max_in]
connect_bd_net [get_bd_pins eth_to_audio_plc_com_0/fade_plc_clear_out] [get_bd_pins audio_fader_1/fade_clear_in]
connect_bd_net [get_bd_pins eth_to_audio_plc_com_0/fade_dpk_clear_out] [get_bd_pins audio_fader_0/fade_clear_in]
connect_bd_net [get_bd_pins eth_to_audio_plc_com_0/fade_dpkt_direction_out] [get_bd_pins audio_fader_0/fade_direction_in]
connect_bd_net [get_bd_pins eth_to_audio_plc_com_0/fade_plc_direction_out] [get_bd_pins audio_fader_1/fade_direction_in]
connect_bd_net [get_bd_pins eth_to_audio_plc_com_0/fade_plc_enable_out] [get_bd_pins audio_fader_1/fade_enable_in]
connect_bd_net [get_bd_pins eth_to_audio_plc_com_0/fade_dpk_enable_out] [get_bd_pins audio_fader_0/fade_enable_in]
connect_bd_net [get_bd_pins eth_to_audio_plc_com_0/fifo_empty_out] [get_bd_pins user_org_plc_seq_ip_0/fifo_empty_in]
connect_bd_net [get_bd_pins eth_to_audio_plc_com_0/fifo_full_out] [get_bd_pins user_org_plc_seq_ip_0/fifo_full_in]
connect_bd_net [get_bd_pins eth_to_audio_plc_com_0/irq_out] [get_bd_pins irq_out]
connect_bd_net [get_bd_pins eth_to_audio_plc_com_0/rx_packet_seq_cnt_out] [get_bd_pins rx_packet_seq_cnt_out]
connect_bd_net [get_bd_pins eth_to_audio_plc_com_0/rx_time_code_out] [get_bd_pins rx_time_code_out]
connect_bd_net [get_bd_pins sync_time_code_in] [get_bd_pins eth_to_audio_plc_com_0/sync_time_code_in]
connect_bd_net [get_bd_pins eth_to_audio_plc_com_0/plc_pkt_end_out] [get_bd_pins user_org_plc_seq_ip_0/replace_pkt_end_in]
connect_bd_net [get_bd_pins user_org_plc_seq_ip_0/new_pkt_ready_out] [get_bd_pins eth_to_audio_plc_com_0/new_pkt_ready_in]
connect_bd_net [get_bd_pins eth_to_audio_plc_com_0/replace_pkt_out] [get_bd_pins user_org_plc_seq_ip_0/replace_pkt_in]
connect_bd_net [get_bd_pins eth_to_audio_plc_com_0/fifo_occ_out] [get_bd_pins user_org_plc_seq_ip_0/fifo_occ_in]
connect_bd_net [get_bd_pins eth_to_audio_plc_com_0/dpk_audio_r_out] [get_bd_pins synchronizer_5/signal_in]
connect_bd_net [get_bd_pins eth_to_audio_plc_com_0/dpk_audio_l_out] [get_bd_pins synchronizer_4/signal_in]
connect_bd_net [get_bd_pins synchronizer_3/signal_out] [get_bd_pins audio_fader_1/IN_SIG_R]
connect_bd_net [get_bd_pins synchronizer_4/signal_out] [get_bd_pins audio_fader_0/IN_SIG_L]
connect_bd_net [get_bd_pins synchronizer_5/signal_out] [get_bd_pins audio_fader_0/IN_SIG_R]
connect_bd_net [get_bd_pins synchronizer_6/signal_out] [get_bd_pins audio_fader_1/IN_SIG_L]
connect_bd_net [get_bd_pins eth_to_audio_plc_com_0/play_out_delay_out] [get_bd_pins user_org_plc_seq_ip_0/play_out_delay_in]
connect_bd_net [get_bd_pins eth_to_audio_plc_com_0/next_play_out_time_out] [get_bd_pins user_org_plc_seq_ip_0/next_play_out_time_in]
connect_bd_net [get_bd_pins eth_to_audio_plc_com_0/current_sync_time_out] [get_bd_pins user_org_plc_seq_ip_0/current_sync_time_in]
connect_bd_net [get_bd_pins eth_to_audio_plc_com_0/newsample_125_out] \
  [get_bd_pins synchronizer_4/sync_clk] [get_bd_pins synchronizer_5/sync_clk] [get_bd_pins synchronizer_6/sync_clk] \
  [get_bd_pins synchronizer_3/sync_clk]
connect_bd_net [get_bd_pins eth_to_audio_plc_com_0/skip_slot_out] [get_bd_pins user_org_plc_seq_ip_0/skip_slot_in]
connect_bd_net [get_bd_pins user_org_plc_seq_ip_0/packet_available_out] [get_bd_pins eth_to_audio_plc_com_0/packet_available_in]
connect_bd_net [get_bd_pins mixer_1/audio_mixed_a_b_left_out] \
  [get_bd_pins FILTER_IIR_1/AUDIO_IN_L] [get_bd_pins OUT_VOLCTRL_L] [get_bd_pins Volume_Pregain_1/IN_SIG_L]

current_bd_instance /
connect_bd_intf_net [get_bd_intf_pins ps7_0_axi_periph/M13_AXI] [get_bd_intf_pins ZedCodec/S00_AXI]
connect_bd_intf_net [get_bd_intf_pins AudioProcessingChannel/fm_udp_s_axis] [get_bd_intf_pins eth_udp_axi_arp_stack_0/m_ch1_audio_payload_axis]
connect_bd_intf_net [get_bd_intf_pins ps7_0_axi_periph/M00_AXI] [get_bd_intf_pins axi_gpio_0/S_AXI]
connect_bd_intf_net [get_bd_intf_ports DDR] [get_bd_intf_pins processing_system7_0/DDR]
connect_bd_intf_net [get_bd_intf_pins AudioProcessingChannel/to_udp_m_axis] [get_bd_intf_pins eth_udp_axi_arp_stack_0/s_audio_payload_axis]
connect_bd_intf_net [get_bd_intf_pins ps7_0_axi_periph/M09_AXI] [get_bd_intf_pins axi_gpio_2/S_AXI]
connect_bd_intf_net [get_bd_intf_pins AudioProcessingChannel/S00_AXI] [get_bd_intf_pins ps7_0_axi_periph/M12_AXI]
connect_bd_intf_net [get_bd_intf_pins ps7_0_axi_periph/M01_AXI] [get_bd_intf_pins FILTER_IIR_0/S00_AXI]
connect_bd_intf_net [get_bd_intf_pins ps7_0_axi_periph/M04_AXI] [get_bd_intf_pins AudioProcessingChannel/S00_AXI1]
connect_bd_intf_net [get_bd_intf_pins ps7_0_axi_periph/M07_AXI] [get_bd_intf_pins pmod_controller_0/S00_AXI]
connect_bd_intf_net [get_bd_intf_pins processing_system7_0/M_AXI_GP0] [get_bd_intf_pins ps7_0_axi_periph/S00_AXI]
connect_bd_intf_net [get_bd_intf_pins ps7_0_axi_periph/M14_AXI] [get_bd_intf_pins time_sync_block_0/S00_AXI]
connect_bd_intf_net [get_bd_intf_pins ps7_0_axi_periph/M10_AXI] [get_bd_intf_pins org_audio2eth_interl_0/S00_AXI]
connect_bd_intf_net [get_bd_intf_pins ps7_0_axi_periph/M15_AXI] [get_bd_intf_pins user_cross_layer_swi_0/S00_AXI]
connect_bd_intf_net [get_bd_intf_pins user_cross_layer_swi_0/s_from_cs_axis] [get_bd_intf_pins eth_udp_axi_arp_stack_0/to_sw_tx_axis]
connect_bd_intf_net [get_bd_intf_pins ps7_0_axi_periph/M06_AXI] [get_bd_intf_pins AudioProcessingChannel/S00_AXI2]
connect_bd_intf_net [get_bd_intf_pins AudioProcessingChannel/fm_audio_s_axis] [get_bd_intf_pins org_audio2eth_interl_0/m_audio_payload_axis]
connect_bd_intf_net [get_bd_intf_pins time_sync_block_0/m_time_sync_axis] [get_bd_intf_pins eth_udp_axi_arp_stack_0/s_time_sync_payload_axis]
connect_bd_intf_net [get_bd_intf_pins ps7_0_axi_periph/M05_AXI] [get_bd_intf_pins AudioProcessingChannel/S00_AXI3]
connect_bd_intf_net [get_bd_intf_pins ps7_0_axi_periph/M02_AXI] [get_bd_intf_pins Volume_Pregain_0/S00_AXI]
connect_bd_intf_net [get_bd_intf_pins ps7_0_axi_periph/M08_AXI] [get_bd_intf_pins axi_gpio_1/S_AXI]
connect_bd_intf_net [get_bd_intf_pins ps7_0_axi_periph/M11_AXI] [get_bd_intf_pins eth_udp_axi_arp_stack_0/S00_AXI]
connect_bd_intf_net [get_bd_intf_pins time_sync_block_0/s_time_sync_axis] [get_bd_intf_pins eth_udp_axi_arp_stack_0/m_time_sync_payload_axis]
connect_bd_intf_net [get_bd_intf_ports FIXED_IO] [get_bd_intf_pins processing_system7_0/FIXED_IO]
connect_bd_intf_net [get_bd_intf_pins user_cross_layer_swi_0/m_to_cs_axis] [get_bd_intf_pins eth_udp_axi_arp_stack_0/from_sw_rx_axis]
connect_bd_intf_net [get_bd_intf_pins ps7_0_axi_periph/M03_AXI] [get_bd_intf_pins ZedboardOLED_0/S00_AXI]
connect_bd_net [get_bd_pins processing_system7_0/FCLK_RESET0_N] [get_bd_pins rst_ps7_0_100M/ext_reset_in] [get_bd_pins clk_wiz_0/resetn]
connect_bd_net [get_bd_pins rst_ps7_0_100M/peripheral_aresetn] \
  [get_bd_pins axi_gpio_0/s_axi_aresetn] [get_bd_pins axi_gpio_1/s_axi_aresetn] [get_bd_pins axi_gpio_2/s_axi_aresetn] \
  [get_bd_pins ps7_0_axi_periph/S00_ARESETN] [get_bd_pins ps7_0_axi_periph/M00_ARESETN] \
  [get_bd_pins ps7_0_axi_periph/M01_ARESETN] [get_bd_pins ps7_0_axi_periph/M02_ARESETN] \
  [get_bd_pins ps7_0_axi_periph/M03_ARESETN] [get_bd_pins ps7_0_axi_periph/M04_ARESETN] \
  [get_bd_pins ps7_0_axi_periph/M05_ARESETN] [get_bd_pins ps7_0_axi_periph/M06_ARESETN] \
  [get_bd_pins ps7_0_axi_periph/M07_ARESETN] [get_bd_pins ps7_0_axi_periph/M08_ARESETN] \
  [get_bd_pins ps7_0_axi_periph/M09_ARESETN] [get_bd_pins ps7_0_axi_periph/M10_ARESETN] \
  [get_bd_pins ps7_0_axi_periph/M11_ARESETN] [get_bd_pins ps7_0_axi_periph/M12_ARESETN] \
  [get_bd_pins ZedCodec/s00_axi_aresetn] [get_bd_pins ps7_0_axi_periph/M13_ARESETN] \
  [get_bd_pins ps7_0_axi_periph/M14_ARESETN] [get_bd_pins AudioProcessingChannel/s00_axi_aresetn] \
  [get_bd_pins ps7_0_axi_periph/M15_ARESETN] [get_bd_pins FILTER_IIR_0/s00_axi_aresetn] \
  [get_bd_pins pmod_controller_0/s00_axi_aresetn] [get_bd_pins ZedboardOLED_0/s00_axi_aresetn] \
  [get_bd_pins user_cross_layer_swi_0/reset_n] [get_bd_pins user_cross_layer_swi_0/s00_axi_aresetn] \
  [get_bd_pins org_audio2eth_interl_0/s00_axi_aresetn] [get_bd_pins time_sync_block_0/s00_axi_aresetn] \
  [get_bd_pins eth_udp_axi_arp_stack_0/reset_n] [get_bd_pins eth_udp_axi_arp_stack_0/s00_axi_aresetn] \
  [get_bd_pins Volume_Pregain_0/s00_axi_aresetn]
connect_bd_net [get_bd_pins rst_ps7_0_100M/interconnect_aresetn] [get_bd_pins ps7_0_axi_periph/ARESETN]
connect_bd_net [get_bd_pins xlconcat_0/dout] [get_bd_pins processing_system7_0/IRQ_F2P]
connect_bd_net -net FILTER_IIR_1_FILTER_DONE [get_bd_pins AudioProcessingChannel/FILTER_DONE] [get_bd_pins xlconcat_0/In2]
connect_bd_net [get_bd_pins ZedboardOLED_0/VDD] [get_bd_ports VDD]
connect_bd_net [get_bd_pins ZedboardOLED_0/RES] [get_bd_ports RES]
connect_bd_net [get_bd_pins ZedboardOLED_0/VBAT] [get_bd_ports VBAT]
connect_bd_net [get_bd_pins ZedboardOLED_0/DC] [get_bd_ports DC]
connect_bd_net [get_bd_pins ZedboardOLED_0/SCLK] [get_bd_ports SCLK]
connect_bd_net [get_bd_pins ZedboardOLED_0/SDIN] [get_bd_ports SDIN]
connect_bd_net [get_bd_pins axi_gpio_1/ip2intc_irpt] [get_bd_pins xlconcat_0/In6]
connect_bd_net [get_bd_pins axi_gpio_2/ip2intc_irpt] [get_bd_pins xlconcat_0/In7]
connect_bd_net [get_bd_pins axi_gpio_0/ip2intc_irpt] [get_bd_pins xlconcat_0/In5]
connect_bd_net -net Volume_Pregain_1_OUT_RDY [get_bd_pins AudioProcessingChannel/SAMPLE_TRIG] [get_bd_pins xlconcat_0/In3]
connect_bd_net [get_bd_pins Volume_Pregain_0/OUT_RDY] [get_bd_pins xlconcat_0/In1] [get_bd_pins FILTER_IIR_0/SAMPLE_TRIG]
connect_bd_net [get_bd_pins FILTER_IIR_0/FILTER_DONE] [get_bd_pins xlconcat_0/In0]
connect_bd_net -net phy_int_n_0_1 [get_bd_ports phy_int_n_0] [get_bd_pins user_cross_layer_swi_0/phy_int_n]
connect_bd_net -net phy_rx_ctl_0_1 [get_bd_ports phy_rx_ctl_0] [get_bd_pins user_cross_layer_swi_0/phy_rx_ctl]
connect_bd_net -net phy_rxd_0_1 [get_bd_ports phy_rxd_0] [get_bd_pins user_cross_layer_swi_0/phy_rxd]
connect_bd_net -net phy_pme_n_0_1 [get_bd_ports phy_pme_n_0] [get_bd_pins user_cross_layer_swi_0/phy_pme_n]
connect_bd_net -net phy_rx_clk_0_1 [get_bd_ports phy_rx_clk_0] [get_bd_pins user_cross_layer_swi_0/phy_rx_clk]
connect_bd_net -net btnc_0_1 [get_bd_ports btnc_0] [get_bd_pins eth_udp_axi_arp_stack_0/btnc]
connect_bd_net -net btnr_0_1 [get_bd_ports btnr_0] [get_bd_pins eth_udp_axi_arp_stack_0/btnr]
connect_bd_net -net btnd_0_1 [get_bd_ports btnd_0] [get_bd_pins eth_udp_axi_arp_stack_0/btnd]
connect_bd_net -net btnl_0_1 [get_bd_ports btnl_0] [get_bd_pins eth_udp_axi_arp_stack_0/btnl]
connect_bd_net -net btnu_0_1 [get_bd_ports btnu_0] [get_bd_pins eth_udp_axi_arp_stack_0/btnu]
connect_bd_net -net clk_wiz_0_clk_100_out [get_bd_pins processing_system7_0/FCLK_CLK0] \
  [get_bd_pins axi_gpio_0/s_axi_aclk] [get_bd_pins axi_gpio_1/s_axi_aclk] [get_bd_pins axi_gpio_2/s_axi_aclk] \
  [get_bd_pins processing_system7_0/M_AXI_GP0_ACLK] [get_bd_pins ps7_0_axi_periph/ACLK] \
  [get_bd_pins ps7_0_axi_periph/S00_ACLK] [get_bd_pins ps7_0_axi_periph/M00_ACLK] [get_bd_pins ps7_0_axi_periph/M01_ACLK] \
  [get_bd_pins ps7_0_axi_periph/M02_ACLK] [get_bd_pins ps7_0_axi_periph/M03_ACLK] [get_bd_pins ps7_0_axi_periph/M04_ACLK] \
  [get_bd_pins ps7_0_axi_periph/M05_ACLK] [get_bd_pins ps7_0_axi_periph/M06_ACLK] [get_bd_pins ps7_0_axi_periph/M07_ACLK] \
  [get_bd_pins ps7_0_axi_periph/M08_ACLK] [get_bd_pins ps7_0_axi_periph/M09_ACLK] \
  [get_bd_pins rst_ps7_0_100M/slowest_sync_clk] [get_bd_pins ps7_0_axi_periph/M10_ACLK] \
  [get_bd_pins ps7_0_axi_periph/M11_ACLK] [get_bd_pins ps7_0_axi_periph/M12_ACLK] [get_bd_pins ZedCodec/s00_axi_aclk] \
  [get_bd_pins ps7_0_axi_periph/M13_ACLK] [get_bd_pins ps7_0_axi_periph/M14_ACLK] \
  [get_bd_pins AudioProcessingChannel/s00_axi_aclk] [get_bd_pins ps7_0_axi_periph/M15_ACLK] \
  [get_bd_pins FILTER_IIR_0/s00_axi_aclk] [get_bd_pins pmod_controller_0/s00_axi_aclk] \
  [get_bd_pins ZedboardOLED_0/s00_axi_aclk] [get_bd_pins user_cross_layer_swi_0/s00_axi_aclk] \
  [get_bd_pins org_audio2eth_interl_0/s00_axi_aclk] [get_bd_pins time_sync_block_0/s00_axi_aclk] \
  [get_bd_pins eth_udp_axi_arp_stack_0/s00_axi_aclk] [get_bd_pins Volume_Pregain_0/s00_axi_aclk]
connect_bd_net -net clk_wiz_0_clk_125_out1 [get_bd_pins user_cross_layer_swi_0/clk_125_out] \
  [get_bd_pins ZedCodec/clk_125] [get_bd_pins AudioProcessingChannel/CLK_125] [get_bd_pins org_audio2eth_interl_0/CLK_125] \
  [get_bd_pins time_sync_block_0/CLK_125] [get_bd_pins eth_udp_axi_arp_stack_0/clk_125_in]
connect_bd_net -net Volume_Pregain_1_OUT_VOLCTRL_L [get_bd_pins AudioProcessingChannel/OUT_VOLCTRL_L] [get_bd_pins mixer_0/audio_channel_b_left_in]
connect_bd_net -net Volume_Pregain_1_OUT_VOLCTRL_R [get_bd_pins AudioProcessingChannel/OUT_VOLCTRL_R] [get_bd_pins mixer_0/audio_channel_b_right_in]
connect_bd_net -net user_org_plc_seq_ip_0_to_udp_hdr_valid [get_bd_pins AudioProcessingChannel/to_udp_hdr_valid] \
  [get_bd_pins eth_udp_axi_arp_stack_0/s_audio_payload_hdr_valid]
connect_bd_net -net user_org_plc_seq_ip_0_status1_out [get_bd_pins AudioProcessingChannel/status1_out] \
  [get_bd_pins eth_udp_axi_arp_stack_0/seq_status1_in]
connect_bd_net -net user_org_plc_seq_ip_0_status2_out [get_bd_pins AudioProcessingChannel/status2_out] \
  [get_bd_pins eth_udp_axi_arp_stack_0/seq_status2_in]
connect_bd_net -net user_org_plc_seq_ip_0_fifo_full_out [get_bd_pins AudioProcessingChannel/fifo_full_out] \
  [get_bd_pins eth_udp_axi_arp_stack_0/fifo_full_in]
connect_bd_net -net user_org_plc_seq_ip_0_fifo_empty_out [get_bd_pins AudioProcessingChannel/fifo_empty_out] \
  [get_bd_pins eth_udp_axi_arp_stack_0/fifo_empty_in]
connect_bd_net -net adau1761_controller_0_adau1761_cclk [get_bd_pins ZedCodec/adau1761_cclk_0] [get_bd_ports adau1761_cclk_0]
connect_bd_net -net adau1761_controller_0_adau1761_clatchn [get_bd_pins ZedCodec/adau1761_clatchn_0] [get_bd_ports adau1761_clatchn_0]
connect_bd_net -net adau1761_controller_0_adau1761_cdata [get_bd_pins ZedCodec/adau1761_cdata_0] [get_bd_ports adau1761_cdata_0]
connect_bd_net -net adau1761_cout_0_1 [get_bd_ports adau1761_cout_0] [get_bd_pins ZedCodec/adau1761_cout_0]
connect_bd_net -net i2s_transmitter_0_sd [get_bd_pins ZedCodec/adau1761_dac_sdata_0] [get_bd_ports adau1761_dac_sdata_0]
connect_bd_net [get_bd_ports adau1761_adc_sdata_0] [get_bd_pins ZedCodec/adau1761_adc_sdata_0]
connect_bd_net [get_bd_ports adau1761_bclk_0] [get_bd_pins ZedCodec/adau1761_bclk_0]
connect_bd_net [get_bd_ports adau1761_lrclk_0] [get_bd_pins ZedCodec/adau1761_lrclk_0]
connect_bd_net [get_bd_pins mixer_0/audio_mixed_a_b_left_out] [get_bd_pins ZedCodec/hphone_l]
connect_bd_net [get_bd_pins mixer_0/audio_mixed_a_b_right_out] [get_bd_pins ZedCodec/hphone_r]
connect_bd_net [get_bd_pins ZedCodec/line_in_r_125] \
  [get_bd_pins AudioProcessingChannel/IN_SIG_R] [get_bd_pins org_audio2eth_interl_0/line_in_r_in] \
  [get_bd_pins FILTER_IIR_0/AUDIO_IN_R] [get_bd_pins mixer_0/audio_channel_a_right_in] \
  [get_bd_pins Volume_Pregain_0/IN_SIG_R]
connect_bd_net [get_bd_pins ZedCodec/line_in_l_125] \
  [get_bd_pins AudioProcessingChannel/IN_SIG_L] [get_bd_pins org_audio2eth_interl_0/line_in_l_in] \
  [get_bd_pins FILTER_IIR_0/AUDIO_IN_L] [get_bd_pins mixer_0/audio_channel_a_left_in] [get_bd_pins Volume_Pregain_0/IN_SIG_L]
connect_bd_net [get_bd_ports clk_100_in] [get_bd_pins clk_wiz_0/clk_in1]
connect_bd_net [get_bd_pins processing_system7_0/FCLK_CLK1] [get_bd_pins user_cross_layer_swi_0/clk_90_in]
connect_bd_net [get_bd_pins processing_system7_0/FCLK_CLK2] [get_bd_pins user_cross_layer_swi_0/clk_125_in]
connect_bd_net [get_bd_pins processing_system7_0/FCLK_CLK3] [get_bd_pins user_cross_layer_swi_0/clk_200_in]
connect_bd_net [get_bd_pins clk_wiz_0/clk_out2] [get_bd_pins user_cross_layer_swi_0/clk_100_in] [get_bd_pins eth_udp_axi_arp_stack_0/clk_100_in]
connect_bd_net [get_bd_pins ZedCodec/next_adc_sample] \
  [get_bd_pins AudioProcessingChannel/new_sample_in] [get_bd_pins org_audio2eth_interl_0/newsample_in] \
  [get_bd_pins time_sync_block_0/newsample_in]
connect_bd_net -net time_sync_block_0_m_audio_payload_hdr_valid [get_bd_pins time_sync_block_0/m_time_sync_hdr_valid] \
  [get_bd_pins eth_udp_axi_arp_stack_0/s_time_sync_payload_hdr_valid]
connect_bd_net [get_bd_pins time_sync_block_0/udp_payload_length] [get_bd_pins eth_udp_axi_arp_stack_0/s_time_sync_payload_length]
connect_bd_net [get_bd_pins time_sync_block_0/initiate_sync_request_out] [get_bd_pins eth_udp_axi_arp_stack_0/initiate_sync_request_in]
connect_bd_net [get_bd_pins time_sync_block_0/sync_done_out] [get_bd_pins eth_udp_axi_arp_stack_0/sync_done_in]
connect_bd_net [get_bd_pins time_sync_block_0/s_time_sync_hdr_ready] [get_bd_pins eth_udp_axi_arp_stack_0/m_time_sync_payload_hdr_ready]
connect_bd_net [get_bd_pins time_sync_block_0/status1_out] [get_bd_pins eth_udp_axi_arp_stack_0/tsync_status1_in]
connect_bd_net [get_bd_pins time_sync_block_0/status2_out] [get_bd_pins eth_udp_axi_arp_stack_0/tsync_status2_in]
connect_bd_net [get_bd_pins time_sync_block_0/sync_request_rx_out] [get_bd_pins eth_udp_axi_arp_stack_0/sync_request_rx_in]
connect_bd_net [get_bd_pins time_sync_block_0/initiate_sync_response_out] [get_bd_pins eth_udp_axi_arp_stack_0/initiate_sync_response_in]
connect_bd_net [get_bd_pins org_audio2eth_interl_0/udp_payload_length] [get_bd_pins eth_udp_axi_arp_stack_0/udp_payload_length]
connect_bd_net -net fm_audio_hdr_valid_1 [get_bd_pins org_audio2eth_interl_0/m_audio_payload_hdr_valid] \
  [get_bd_pins AudioProcessingChannel/fm_audio_hdr_valid]
connect_bd_net [get_bd_pins org_audio2eth_interl_0/sync_en_out] [get_bd_ports sync_en_out_0]
connect_bd_net [get_bd_pins org_audio2eth_interl_0/tsync_out] [get_bd_ports tsync_out_0]
connect_bd_net [get_bd_pins org_audio2eth_interl_0/irq_out] [get_bd_pins xlconcat_0/In8]
connect_bd_net [get_bd_pins user_cross_layer_swi_0/ps_gmii_tx_clk] [get_bd_pins processing_system7_0/ENET1_GMII_TX_CLK]
connect_bd_net [get_bd_pins user_cross_layer_swi_0/ps_gmii_rx_clk] [get_bd_pins processing_system7_0/ENET1_GMII_RX_CLK]
connect_bd_net [get_bd_pins user_cross_layer_swi_0/to_ps_gmii_rxd] [get_bd_pins processing_system7_0/ENET1_GMII_RXD]
connect_bd_net [get_bd_pins processing_system7_0/ENET1_GMII_TXD] [get_bd_pins user_cross_layer_swi_0/from_ps_gmii_txd]
connect_bd_net [get_bd_pins processing_system7_0/ENET1_GMII_TX_ER] [get_bd_pins user_cross_layer_swi_0/from_ps_gmii_tx_er]
connect_bd_net [get_bd_pins processing_system7_0/ENET1_GMII_TX_EN] [get_bd_pins user_cross_layer_swi_0/from_ps_gmii_tx_en]
connect_bd_net [get_bd_pins user_cross_layer_swi_0/to_ps_gmii_rx_dv] [get_bd_pins processing_system7_0/ENET1_GMII_RX_DV]
connect_bd_net [get_bd_pins user_cross_layer_swi_0/to_ps_gmii_rx_er] [get_bd_pins processing_system7_0/ENET1_GMII_RX_ER]
connect_bd_net [get_bd_pins user_cross_layer_swi_0/to_ps_gmii_col] [get_bd_pins processing_system7_0/ENET1_GMII_COL]
connect_bd_net [get_bd_pins user_cross_layer_swi_0/to_ps_gmii_crs] [get_bd_pins processing_system7_0/ENET1_GMII_CRS]
connect_bd_net [get_bd_pins user_cross_layer_swi_0/phy_tx_clk] [get_bd_ports phy_tx_clk_0]
connect_bd_net [get_bd_pins user_cross_layer_swi_0/phy_tx_ctl] [get_bd_ports phy_tx_ctl_0]
connect_bd_net [get_bd_pins user_cross_layer_swi_0/phy_reset_n] [get_bd_ports phy_reset_n_0]
connect_bd_net [get_bd_pins user_cross_layer_swi_0/phy_txd] [get_bd_ports phy_txd_0]
connect_bd_net [get_bd_pins user_cross_layer_swi_0/rst_out] \
  [get_bd_pins AudioProcessingChannel/rst_in] [get_bd_pins ZedCodec/rst] [get_bd_pins eth_udp_axi_arp_stack_0/rst_in]
connect_bd_net [get_bd_pins processing_system7_0/ENET1_MDIO_MDC] [get_bd_pins user_cross_layer_swi_0/mdc_o]
connect_bd_net [get_bd_pins processing_system7_0/ENET1_MDIO_O] [get_bd_pins user_cross_layer_swi_0/mdio_o]
connect_bd_net [get_bd_pins processing_system7_0/ENET1_MDIO_T] [get_bd_pins user_cross_layer_swi_0/mdio_t]
connect_bd_net [get_bd_pins user_cross_layer_swi_0/mdio_i] [get_bd_pins processing_system7_0/ENET1_MDIO_I]
connect_bd_net [get_bd_ports phy_mdio_0] [get_bd_pins user_cross_layer_swi_0/phy_mdio]
connect_bd_net [get_bd_pins user_cross_layer_swi_0/phy_mdc] [get_bd_ports phy_mdc_0]
connect_bd_net [get_bd_pins eth_udp_axi_arp_stack_0/led] [get_bd_ports led_0]
connect_bd_net [get_bd_pins eth_udp_axi_arp_stack_0/s_time_sync_payload_hdr_ready] [get_bd_pins time_sync_block_0/m_time_sync_hdr_ready]
connect_bd_net [get_bd_pins eth_udp_axi_arp_stack_0/s_audio_payload_hdr_ready] [get_bd_pins org_audio2eth_interl_0/m_audio_payload_hdr_ready]
connect_bd_net -net fm_audio_s_axis_aresetn_1 [get_bd_pins eth_udp_axi_arp_stack_0/stream_resetn_out] \
  [get_bd_pins AudioProcessingChannel/fm_audio_s_axis_aresetn]
connect_bd_net [get_bd_pins user_cross_layer_swi_0/sel_status] [get_bd_pins eth_udp_axi_arp_stack_0/sw_sel_status]
connect_bd_net [get_bd_pins user_cross_layer_swi_0/from_ps_fifo_status_overflow] [get_bd_pins eth_udp_axi_arp_stack_0/from_sw_tx_fifo_overflow]
connect_bd_net [get_bd_pins user_cross_layer_swi_0/from_ps_fifo_status_bad_frame] [get_bd_pins eth_udp_axi_arp_stack_0/from_sw_tx_fifo_bad_frame]
connect_bd_net [get_bd_pins user_cross_layer_swi_0/from_ps_fifo_status_good_frame] [get_bd_pins eth_udp_axi_arp_stack_0/from_sw_tx_fifo_good_frame]
connect_bd_net [get_bd_pins user_cross_layer_swi_0/from_ps_error_bad_frame] [get_bd_pins eth_udp_axi_arp_stack_0/from_sw_rx_error_bad_frame]
connect_bd_net [get_bd_pins user_cross_layer_swi_0/from_ps_error_bad_fcs] [get_bd_pins eth_udp_axi_arp_stack_0/from_sw_rx_error_bad_fcs]
connect_bd_net [get_bd_pins user_cross_layer_swi_0/mac_status_overflow] [get_bd_pins eth_udp_axi_arp_stack_0/from_sw_rx_fifo_overflow]
connect_bd_net [get_bd_pins user_cross_layer_swi_0/mac_status_bad_frame] [get_bd_pins eth_udp_axi_arp_stack_0/from_sw_rx_fifo_bad_frame]
connect_bd_net [get_bd_pins user_cross_layer_swi_0/mac_status_good_frame] [get_bd_pins eth_udp_axi_arp_stack_0/from_sw_rx_fifo_good_frame]
connect_bd_net [get_bd_pins time_sync_block_0/sync_time_code_out] \
  [get_bd_pins AudioProcessingChannel/sync_time_code_in] [get_bd_pins org_audio2eth_interl_0/tx_time_code_in]
connect_bd_net -net sync_en_in_0_1 [get_bd_pins time_sync_block_0/tc_sync_en_out] \
  [get_bd_pins AudioProcessingChannel/sync_en_in_0] [get_bd_pins org_audio2eth_interl_0/tc_sync_en_in]
connect_bd_net [get_bd_pins AudioProcessingChannel/path_tc_valid_out] [get_bd_pins time_sync_block_0/path_tc_valid_in]
connect_bd_net [get_bd_pins AudioProcessingChannel/path_tx_tc_code_out] [get_bd_pins time_sync_block_0/path_tx_tc_code_in]
connect_bd_net [get_bd_pins AudioProcessingChannel/path_rx_tc_code_out] \
  [get_bd_pins org_audio2eth_interl_0/rx_time_code_in] [get_bd_pins time_sync_block_0/path_rx_tc_code_in]
connect_bd_net [get_bd_pins eth_udp_axi_arp_stack_0/media_pkt_tx_en_out] [get_bd_pins time_sync_block_0/media_pkt_tx_en_in]
connect_bd_net [get_bd_pins AudioProcessingChannel/path_rx_seq_num_out] [get_bd_pins org_audio2eth_interl_0/rx_packet_seq_cnt_in]
connect_bd_net -net eth_to_audio_plc_com_0_s_ch1_audio_payload_hdr_ready [get_bd_pins AudioProcessingChannel/s_ch1_audio_payload_hdr_ready] \
  [get_bd_pins eth_udp_axi_arp_stack_0/m_ch1_audio_payload_hdr_ready]
connect_bd_net -net eth_to_audio_plc_com_0_irq_out [get_bd_pins AudioProcessingChannel/irq_out] [get_bd_pins xlconcat_0/In9]
connect_bd_net -net serial_data_in1_0_1 [get_bd_ports serial_data_in1_0] [get_bd_pins ZedCodec/serial_data_in1_0]
connect_bd_net [get_bd_pins ZedCodec/mclk1_0] [get_bd_ports mclk1_0]
connect_bd_net [get_bd_pins ZedCodec/bclk1_0] [get_bd_ports bclk1_0]
connect_bd_net [get_bd_pins ZedCodec/lrclk1_0] [get_bd_ports lrclk1_0]
connect_bd_net [get_bd_pins ZedCodec/ctrl_sw_out_0] [get_bd_ports ctrl_sw_out_0]
connect_bd_net [get_bd_pins ZedCodec/adau1761_mclk] [get_bd_ports adau1761_mclk]
connect_bd_net [get_bd_pins clk_wiz_0/clk_out1] [get_bd_pins ZedCodec/mclk_cw]
connect_bd_net [get_bd_pins ZedCodec/serial_data_out1_0] [get_bd_ports serial_data_out1_0]
connect_bd_net [get_bd_pins pmod_controller_0/Rotary_event] [get_bd_pins xlconcat_0/In4]
connect_bd_net -net sw_0_1 [get_bd_ports sw_0] [get_bd_pins ZedCodec/sw]

# ---- address map ----
assign_bd_address -offset 0x41200000 -range 64K -target_address_space [get_bd_addr_spaces processing_system7_0/Data] [get_bd_addr_segs axi_gpio_0/S_AXI/Reg]
assign_bd_address -offset 0x41210000 -range 64K -target_address_space [get_bd_addr_spaces processing_system7_0/Data] [get_bd_addr_segs axi_gpio_1/S_AXI/Reg]
assign_bd_address -offset 0x41220000 -range 64K -target_address_space [get_bd_addr_spaces processing_system7_0/Data] [get_bd_addr_segs axi_gpio_2/S_AXI/Reg]
assign_bd_address -offset 0x43C00000 -range 64K -target_address_space [get_bd_addr_spaces processing_system7_0/Data] [get_bd_addr_segs FILTER_IIR_0/S00_AXI/S00_AXI_reg]
assign_bd_address -offset 0x43C10000 -range 64K -target_address_space [get_bd_addr_spaces processing_system7_0/Data] [get_bd_addr_segs AudioProcessingChannel/FILTER_IIR_1/S00_AXI/S00_AXI_reg]
assign_bd_address -offset 0x43C20000 -range 64K -target_address_space [get_bd_addr_spaces processing_system7_0/Data] [get_bd_addr_segs Volume_Pregain_0/S00_AXI/S00_AXI_reg]
assign_bd_address -offset 0x43C30000 -range 64K -target_address_space [get_bd_addr_spaces processing_system7_0/Data] [get_bd_addr_segs AudioProcessingChannel/Volume_Pregain_1/S00_AXI/S00_AXI_reg]
assign_bd_address -offset 0x43C40000 -range 64K -target_address_space [get_bd_addr_spaces processing_system7_0/Data] [get_bd_addr_segs ZedCodec/adau1761_controller_0/S00_AXI/S00_AXI_reg]
assign_bd_address -offset 0x43C50000 -range 64K -target_address_space [get_bd_addr_spaces processing_system7_0/Data] [get_bd_addr_segs ZedboardOLED_0/S00_AXI/S00_AXI_reg]
assign_bd_address -offset 0x43C60000 -range 64K -target_address_space [get_bd_addr_spaces processing_system7_0/Data] [get_bd_addr_segs org_audio2eth_interl_0/S00_AXI/S00_AXI_reg]
assign_bd_address -offset 0x43C70000 -range 64K -target_address_space [get_bd_addr_spaces processing_system7_0/Data] [get_bd_addr_segs AudioProcessingChannel/eth_to_audio_plc_com_0/S00_AXI/S00_AXI_reg]
assign_bd_address -offset 0x43C80000 -range 64K -target_address_space [get_bd_addr_spaces processing_system7_0/Data] [get_bd_addr_segs eth_udp_axi_arp_stack_0/S00_AXI/S00_AXI_reg]
assign_bd_address -offset 0x43C90000 -range 64K -target_address_space [get_bd_addr_spaces processing_system7_0/Data] [get_bd_addr_segs pmod_controller_0/S00_AXI/S00_AXI_reg]
assign_bd_address -offset 0x43CA0000 -range 64K -target_address_space [get_bd_addr_spaces processing_system7_0/Data] [get_bd_addr_segs AudioProcessingChannel/user_org_plc_seq_ip_0/S00_AXI/S00_AXI_reg]
assign_bd_address -offset 0x43CB0000 -range 64K -target_address_space [get_bd_addr_spaces processing_system7_0/Data] [get_bd_addr_segs time_sync_block_0/S00_AXI/S00_AXI_reg]
assign_bd_address -offset 0x43CC0000 -range 64K -target_address_space [get_bd_addr_spaces processing_system7_0/Data] [get_bd_addr_segs user_cross_layer_swi_0/S00_AXI/S00_AXI_reg]

validate_bd_design
save_bd_design
